# Altium schematic sheet [01] - SheetConnector.SchDoc: =ProjectName
size A4; CheckedBy: Ven; Author: Ven; CompanyName: HUST; Revision: V.1.0
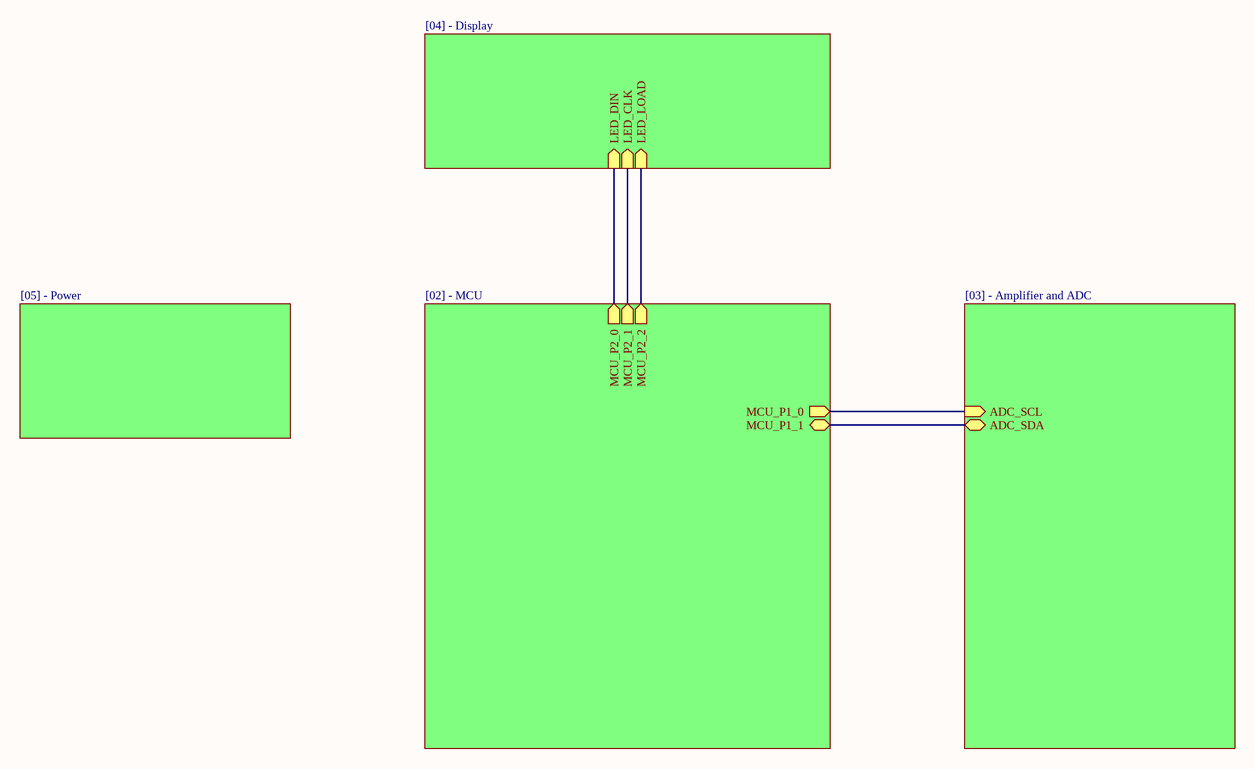
[diagram p0: [01] - SheetConnector.SchDoc]

## Sub-sheets
1 = [04] - Display: LED_DIN (in), LED_CLK (in), LED_LOAD (in)
2 = [02] - MCU: MCU_P2_1 (out), MCU_P2_0 (out), MCU_P2_2 (out), MCU_P1_0 (out), MCU_P1_1 (bidir)
3 = [03] - Amplifier and ADC: ADC_SCL (in), ADC_SDA (bidir)
4 = [05] - Power: no entries

## Nets
(unnamed): sheet 2/MCU_P2_1, sheet 1/LED_CLK
(unnamed): sheet 2/MCU_P2_0, sheet 1/LED_DIN
(unnamed): sheet 2/MCU_P2_2, sheet 1/LED_LOAD
(unnamed): sheet 2/MCU_P1_0, sheet 3/ADC_SCL
(unnamed): sheet 2/MCU_P1_1, sheet 3/ADC_SDA

## Notes on the sheet
- Project:
- Page Contents:
- Size:
- Date:
- A4
- Checked by:
- Time:
- Revision:
- Sheet
- of
- File: